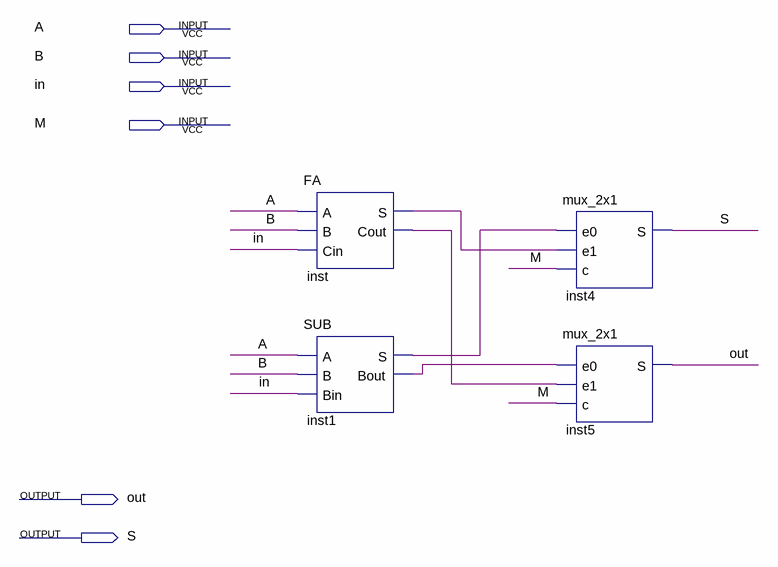
[diagram p0: schematic sheet]
// Quartus schematic HAS.bdf as structural Verilog: 4 symbols, 6 pins
module HAS (
  input  A,
  input  B,
  input  in,
  input  M,
  output out,
  output S
);

  wire inst1_bout, inst1_s, inst_cout, inst_s;

  FA inst (.A(A), .B(B), .Cin(in), .S(inst_s), .Cout(inst_cout));
  SUB inst1 (.A(A), .B(B), .Bin(in), .S(inst1_s), .Bout(inst1_bout));
  mux_2x1 inst4 (.e0(inst1_s), .e1(inst_s), .c(M), .S(S));
  mux_2x1 inst5 (.e0(inst1_bout), .e1(inst_cout), .c(M), .S(out));
endmodule
